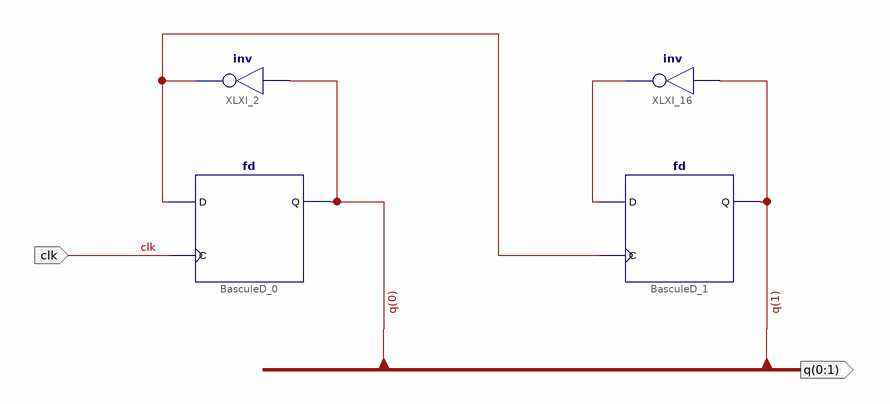
[diagram p0: schematic sheet 1]
// Xilinx ISE schematic compteur4.sch (spartan3e) as structural Verilog: 4 symbols, 2 ports
module compteur4 (
  input  clk,
  output [0:1] q
);

  wire XLXN_31, XLXN_33;

  fd BasculeD_0 (.C(clk), .D(XLXN_33), .Q(q[0]));
  not XLXI_2 (XLXN_33, q[0]);
  fd BasculeD_1 (.C(XLXN_33), .D(XLXN_31), .Q(q[1]));
  not XLXI_16 (XLXN_31, q[1]);
endmodule
